# Altium schematic sheet STM32.SchDoc
size A4; SheetNumber: 6; SheetTotal: 10
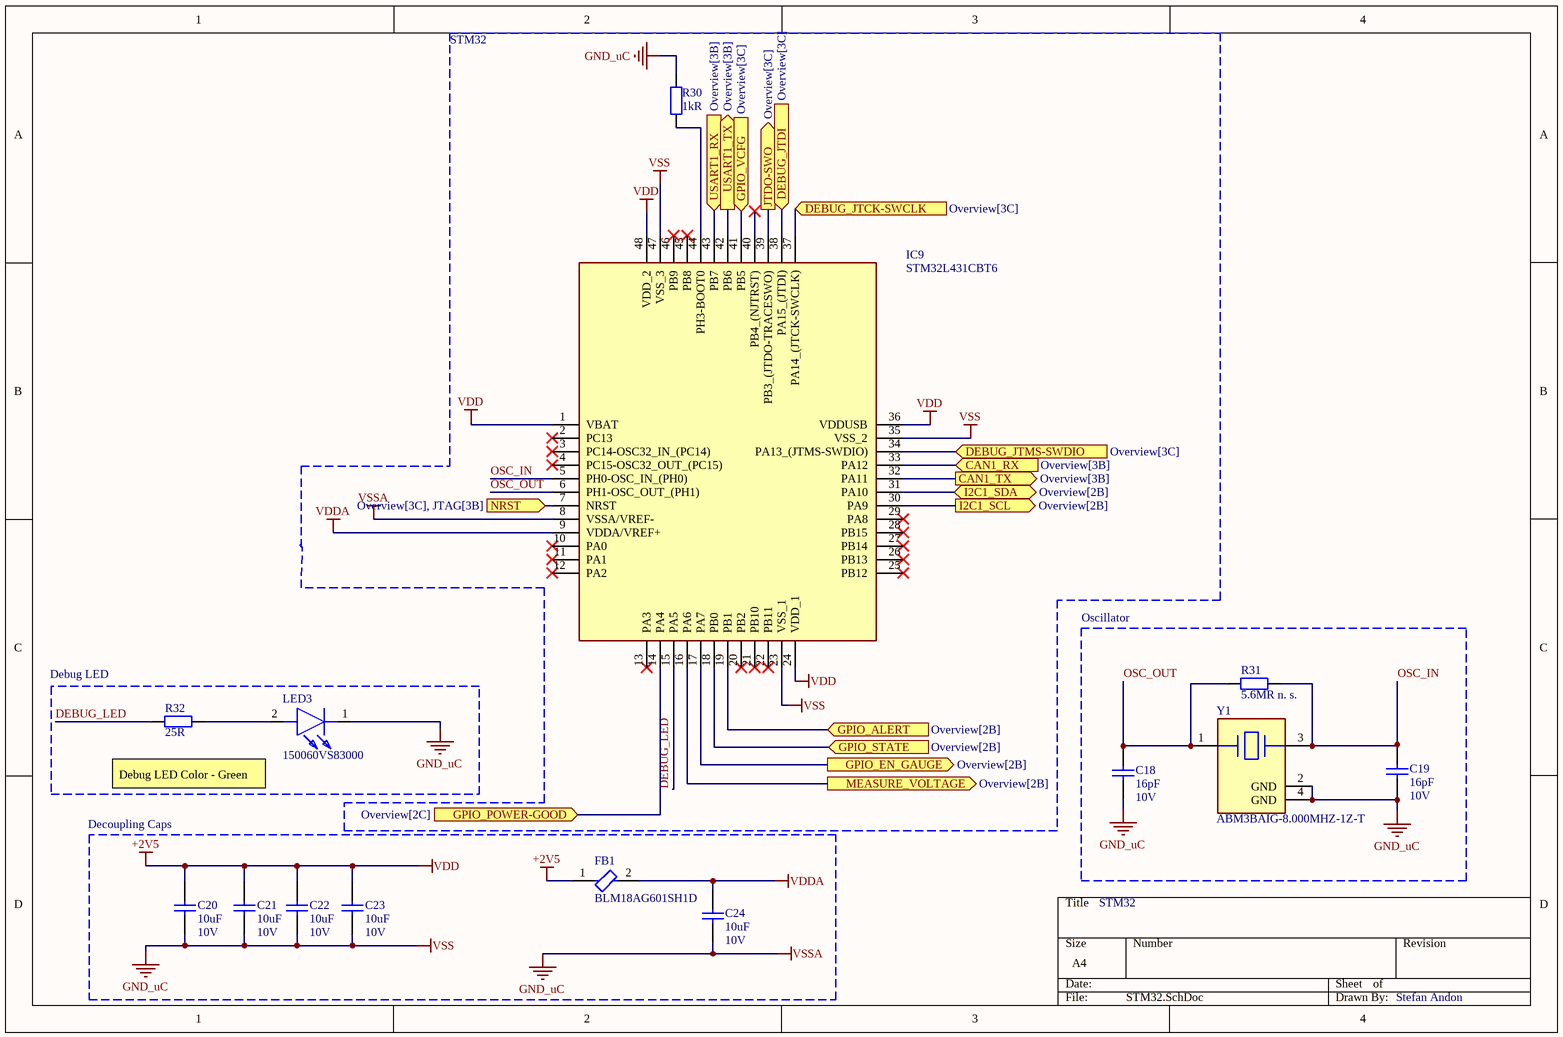
[diagram p0: STM32.SchDoc]

## Parts
C18  value 16pF  Voltage: 10V  [CAP_0603]  (hidden comment: Capacitor_SMD)
C19  value 16pF  Voltage: 10V  [CAP_0603]  (hidden comment: Capacitor_SMD)
C20  value 10uF  Voltage: 10V  [CAP_0603]  (hidden comment: Capacitor_SMD)
C21  value 10uF  Voltage: 10V  [CAP_0603]  (hidden comment: Capacitor_SMD)
C22  value 10uF  Voltage: 10V  [CAP_0603]  (hidden comment: Capacitor_SMD)
C23  value 10uF  Voltage: 10V  [CAP_0603]  (hidden comment: Capacitor_SMD)
C24  value 10uF  Voltage: 10V  [CAP_0603]  (hidden comment: Capacitor_SMD)
FB1  BLM18AG601SH1D  [FP-BLM18-0_15-t0_8-MFG]
IC9  STM32L431CBT6  [QFP50P900X900X160-48N]
LED3  150060VS83000  [150060VS83000]
R30  value 1kR  [RES_0603]  (hidden comment: Resistor_SMD)
R31  value 5.6MR n. s.  [RES_0603]  (hidden comment: Resistor_SMD)
R32  value 25R  [RES_0603]  (hidden comment: Resistor_SMD)
Y1  ABM3BAIG-8.000MHZ-1Z-T  [FP-ABM3BAIG-MFG]

## Blocks framed on the sheet
Oscillator: C18 C19 R31 Y1
Debug LED: LED3 R32
Decoupling Caps: C20-C24 FB1

## Ports
CAN1_RX (in, see Overview[3B]), CAN1_TX (out, see Overview[3B]), DEBUG_JTCK-SWCLK (in, see Overview[3C]), DEBUG_JTDI (in, see Overview[3C]), DEBUG_JTMS-SWDIO (in, see Overview[3C]), GPIO_ALERT (in, see Overview[2B]), GPIO_EN_GAUGE (out, see Overview[2B]), GPIO_POWER-GOOD (in, see Overview[2C]), GPIO_STATE (in, see Overview[2B]), GPIO_VCFG (in, see Overview[3C]), I2C1_SCL (out, see Overview[2B]), I2C1_SDA (bidir, see Overview[2B]), JTDO-SWO (out, see Overview[3C]), MEASURE_VOLTAGE (out, see Overview[2B]), NRST (in, see Overview[3C], JTAG[3B]), USART1_RX (in, see Overview[3B]), USART1_TX (out, see Overview[3B])

## Nets
+2V5: C20.1 C21.1 C22.1 C23.1 FB1.1 IC9.1(VBAT) IC9.24(VDD_1) IC9.36(VDDUSB) IC9.48(VDD_2)  [also labelled VDD]
GND_uC: C18.2 C19.2 C20.2 C21.2 C22.2 C23.2 C24.2 IC9.8(VSSA/VREF-) IC9.23(VSS_1) IC9.35(VSS_2) IC9.47(VSS_3) LED3.1(K) R30.1 Y1.2(GND) Y1.4(GND)  [also labelled VSS, VSSA]
VDDA: C24.1 FB1.2 IC9.9(VDDA/VREF+)
CAN1_RX: IC9.33(PA12) ; port CAN1_RX
CAN1_TX: IC9.32(PA11) ; port CAN1_TX
DEBUG_JTCK-SWCLK: IC9.37(PA14_(JTCK-SWCLK)) ; port DEBUG_JTCK-SWCLK
DEBUG_JTDI: IC9.38(PA15_(JTDI)) ; port DEBUG_JTDI
DEBUG_JTMS-SWDIO: IC9.34(PA13_(JTMS-SWDIO)) ; port DEBUG_JTMS-SWDIO
DEBUG_LED: IC9.15(PA5) R32.2
GPIO_ALERT: IC9.19(PB1) ; port GPIO_ALERT
GPIO_EN_GAUGE: IC9.17(PA7) ; port GPIO_EN_GAUGE
GPIO_POWER-GOOD: IC9.14(PA4) ; port GPIO_POWER-GOOD
GPIO_STATE: IC9.18(PB0) ; port GPIO_STATE
GPIO_VCFG: IC9.41(PB5) ; port GPIO_VCFG
I2C1_SCL: IC9.30(PA9) ; port I2C1_SCL
I2C1_SDA: IC9.31(PA10) ; port I2C1_SDA
JTDO-SWO: IC9.39(PB3_(JTDO-TRACESWO)) ; port JTDO-SWO
MEASURE_VOLTAGE: IC9.16(PA6) ; port MEASURE_VOLTAGE
NRST: IC9.7(NRST) ; port NRST
OSC_IN: C19.1 IC9.5(PH0-OSC_IN_(PH0)) R31.1 Y1.3
OSC_OUT: C18.1 IC9.6(PH1-OSC_OUT_(PH1)) R31.2 Y1.1
USART1_RX: IC9.43(PB7) ; port USART1_RX
USART1_TX: IC9.42(PB6) ; port USART1_TX
NetIC9_44: IC9.44(PH3-BOOT0) R30.2
NetLED3_2: LED3.2(A) R32.1

Not connected (* = marked no-connect by the designer): IC9 2(PC13)* 3(PC14-OSC32_IN_(PC14))* 4(PC15-OSC32_OUT_(PC15))* 10(PA0)* 11(PA1)* 12(PA2)* 13(PA3)* 20(PB2)* 21(PB10)* 22(PB11)* 25(PB12)* 26(PB13)* 27(PB14)* 28(PB15)* 29(PA8)* 40(PB4_(NJTRST))* 45(PB8)* 46(PB9)*

## Notes on the sheet
- STM32
- Debug LED Color - Green
- Stefan Andon

## Library data of the parts
C18 C19 = CMP-001-0004-13: SMD Capacitor; Tolerance: tbd; BOM: 16pF, 10V, tbd, tbd,CAP_0603; Dielectric: tbd; Package: tbd
C20-C24 = CMP-001-0004-13: SMD Capacitor; Tolerance: tbd; BOM: 10uF, 10V, tbd, tbd,CAP_0603; Dielectric: tbd; Package: tbd
FB1 = CMP-2000-05953-2: Chip Ferrite Bead, 0603, 600Ω @ 100MHz, 0.38Ω, 25%, 500mA; Current Rating: 200mA; Impedance: 600R; Number of Lines: 1; DC Resistance (DCR): 380mR; Shielding: Unshielded; Material: Steel; Case Code (Metric): 1608; Radiation Hardening: No; Mount: Surface Mount; Series: EMIFIL®, BLM18A; Package Quantity: 4000; Length: 1.6mm; Depth: 0.8mm; Max Operating Temperature: 125°C; RoHS Compliant: Yes; Case/Package: 0603; Max DC Current: 200mA; Lead Free: Lead Free; Min Operating Temperature: -55°C; Packaging: Tape and Reel; Case Code (Imperial): 0603; Test Frequency: 100MHz; Termination: Flat; Number of Circuits: 1; Height: 0.8mm; Tolerance: 25%; Max Current Rating: 500mA; Contact Plating: Tin; Width: 0.8mm; Ratings: AEC-Q200
IC9 = STM32L431CBT6: Integrated Circuit; Manufacturer_Name: STMicroelectronics; Datasheet Link: https://www.st.com/resource/en/datasheet/stm32l431cb.pdf; Height: 1.6mm; Manufacturer_Part_Number: STM32L431CBT6; Mouser Part Number: 511-STM32L431CBT6; Mouser Price/Stock: https://www.mouser.co.uk/ProductDetail/STMicroelectronics/STM32L431CBT6?qs=U58vgkJzipQlQfAJeHTS0w%3D%3D; Arrow Part Number: STM32L431CBT6; Arrow Price/Stock: https://www.arrow.com/en/products/stm32l431cbt6/stmicroelectronics?utm_currency=USD&region=nac
LED3 = 150060VS83000: LED; Manufacturer_Name: Wurth Elektronik; Datasheet Link: https://www.we-online.com/catalog/datasheet/150060SV83000.pdf; Height: 1.15mm; Manufacturer_Part_Number: 150060VS83000
R30-R32 = CMP-001-0003-18: Tolerance: tbd; Power: 7W; BOM: Value+', '+Power+', '+Tolerance+', '+CurrentFootprint; Package: tbd
Y1 = CMP-27762-004085-1: CRYSTAL 8.0000MHZ 18PF SMD